# Altium schematic sheet RX_Board.SchDoc (part 4 of 5)
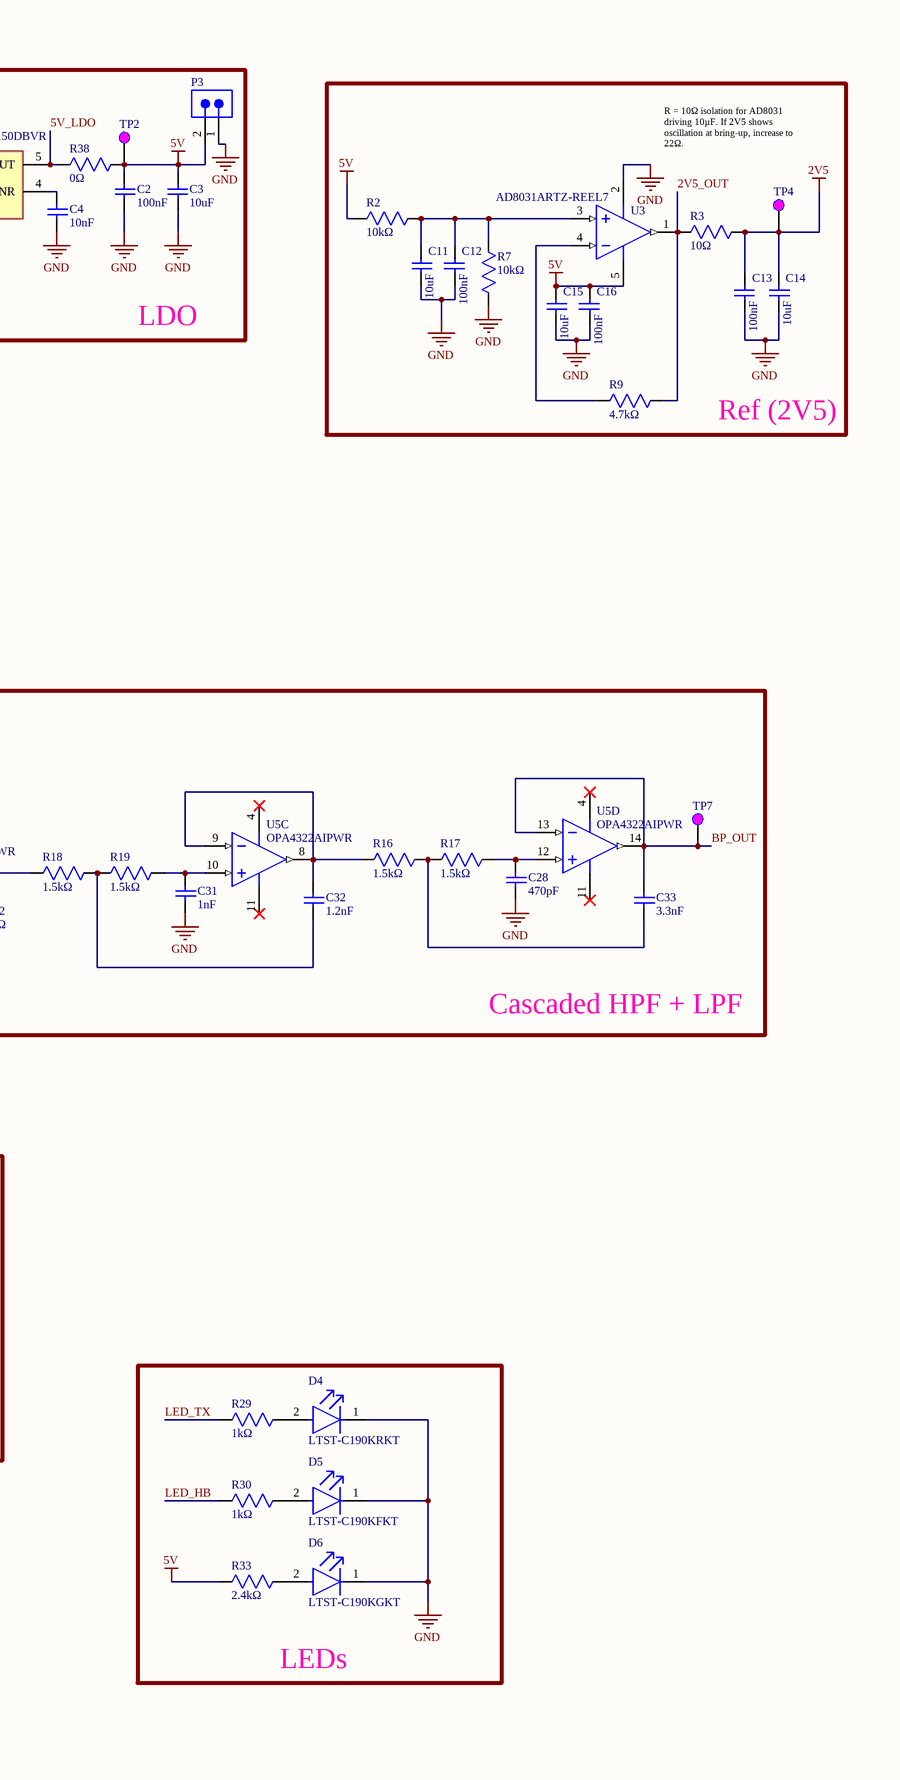
[diagram p4: RX_Board.SchDoc, right]

## Library data of the parts (continued)
R6 R8 R9 R31 = RC0603FR-074K7L: Yageo RC0603FR-074K7L Resistor 0603 SMD 4.7k Ohm 1% 100mW Thick Film; Manufacturer: Yageo Group; Temperature Coefficient: 100ppm/°C; Voltage Rating: 75V; Voltage Rating (DC): 50V; Supplier: Newark; Supplier Part Number: RC0603FR-074K7L; Manufacturer Part Number: RC0603FR-074K7L; RoHS: Compliant; Category: Chip SMD Resistors; Stock: 339015; Pricing: 10=0.018, 20=0.016, 30=0.015, 50=0.013, 100=0.012, 250=0.011, 500=0.010, 1000=0.009 (USD); Case/Package: 0603; Case Code (Imperial): 0603; China RoHS: Non-Compliant; Composition: Thick Film; Contact Plating: Tin; Country of Origin: Mainland China, Taiwan; Depth: 800µm; Export Control Classification Number (ECCN) Code: EAR99; Height: 450µm; Harmonized Tariff Schedule (HTS) Code: 8533.21.00.30; Introduction Date: 2004-09-22; Lead Free: Lead Free; Lead Pitch: 300µm; Length: 1.6mm; Lifecycle Status: Production; Max Operating Temperature: 155°C; Military Standard: Not; Min Operating Temperature: -55°C; Mounting Technology: Surface Mount; Pins: 2; Number of Terminals: 2; Packaging: Tape & Reel; Power Rating: 100mW; Radiation Hardening: No; REACH SVHC: Unaffected; Value: 4.7kΩ; Schedule B: 8533210045, 8533210045|8533210045|8533210045|8533210045|8533210045|8533210045|8533210045|8533210045|8533210045|8533210045|8533210045|8533210045|8533210045|8533210045|8533210045|8533210045|8533210045|8533210045|8533210045|8533210045|8533210045|8533210045|8533210045|85; Termination: SMD/SMT; Tolerance: 1%; Width: 800µm; Working Voltage: 75V; ComponentLink1URL: https://datasheet.octopart.com:443/RC0603FR-074K7L-Yageo-datasheet-175887523.pdf?src-supplier=IHS; ComponentLink1Description: https://datasheet.octopart.com:443/RC0603FR-074K7L-Yageo-datasheet-175887523.pdf?src-supplier=IHS; ComponentLink2URL: https://datasheet.octopart.com:443/RC0603FR-074K7L-Yageo-datasheet-103092701.pdf?src-supplier=Upverter; ComponentLink2Description: https://datasheet.octopart.com:443/RC0603FR-074K7L-Yageo-datasheet-103092701.pdf?src-supplier=Upverter; ComponentLink3URL: https://datasheet.octopart.com:443/RC0603FR-074K7L-Yageo-datasheet-8328172.pdf?src-supplier=Farnell; ComponentLink3Description: https://datasheet.octopart.com:443/RC0603FR-074K7L-Yageo-datasheet-8328172.pdf?src-supplier=Farnell; ComponentLink4URL: https://datasheet.octopart.com:443/RC0603FR-074K7L-Yageo-datasheet-13691069.pdf?src-supplier=Farnell; ComponentLink4Description: https://datasheet.octopart.com:443/RC0603FR-074K7L-Yageo-datasheet-13691069.pdf?src-supplier=Farnell; ComponentLink5URL: https://datasheet.octopart.com:443/RC0603FR-074K7L-Yageo-Group-datasheet-190305687.pdf?src-supplier=Future+Electronics; ComponentLink5Description: https://datasheet.octopart.com:443/RC0603FR-074K7L-Yageo-Group-datasheet-190305687.pdf?src-supplier=Future+Electronics; ComponentLink6URL: https://datasheet.octopart.com:443/RC0603FR-074K7L-Yageo-datasheet-164759695.pdf?src-supplier=Future+Electronics; ComponentLink6Description: https://datasheet.octopart.com:443/RC0603FR-074K7L-Yageo-datasheet-164759695.pdf?src-supplier=Future+Electronics; ComponentLink7URL: https://datasheet.octopart.com:443/RC0603FR-074K7L-Yageo-datasheet-137700087.pdf?src-supplier=Future+Electronics; ComponentLink7Description: https://datasheet.octopart.com:443/RC0603FR-074K7L-Yageo-datasheet-137700087.pdf?src-supplier=Future+Electronics; ComponentLink8URL: https://datasheet.octopart.com:443/RC0603FR074K7L-Yageo-datasheet-27584510.pdf?src-supplier=Future+Electronics; ComponentLink8Description: https://datasheet.octopart.com:443/RC0603FR074K7L-Yageo-datasheet-27584510.pdf?src-supplier=Future+Electronics; ComponentLink9URL: https://datasheet.octopart.com:443/RC0603FR-074K7L-Yageo-datasheet-15599030.pdf?src-supplier=Future+Electronics; ComponentLink9Description: https://datasheet.octopart.com:443/RC0603FR-074K7L-Yageo-datasheet-15599030.pdf?src-supplier=Future+Electronics; ComponentLink10URL: https://datasheet.octopart.com:443/RC0603FR-074K7L-Yageo-datasheet-175423674.pdf?src-supplier=Newark; ComponentLink10Description: https://datasheet.octopart.com:443/RC0603FR-074K7L-Yageo-datasheet-175423674.pdf?src-supplier=Newark; ComponentLink11URL: https://datasheet.octopart.com:443/RC0603FR-074K7L-Yageo-datasheet-12596169.pdf?src-supplier=Newark; ComponentLink11Description: https://datasheet.octopart.com:443/RC0603FR-074K7L-Yageo-datasheet-12596169.pdf?src-supplier=Newark; ComponentLink12URL: https://datasheet.octopart.com:443/RC0603FR-074K7L-Yageo-datasheet-503470.pdf?src-supplier=Newark; ComponentLink12Description: https://datasheet.octopart.com:443/RC0603FR-074K7L-Yageo-datasheet-503470.pdf?src-supplier=Newark; ComponentLink13URL: https://datasheet.octopart.com:443/RC0603FR-074K7L-Yageo-datasheet-34211833.pdf?src-supplier=element14+APAC; ComponentLink13Description: https://datasheet.octopart.com:443/RC0603FR-074K7L-Yageo-datasheet-34211833.pdf?src-supplier=element14+APAC; ComponentLink14URL: https://datasheet.octopart.com:443/RC0603FR-074K7L-Yageo-datasheet-62067350.pdf?src-supplier=element14+APAC; ComponentLink14Description: https://datasheet.octopart.com:443/RC0603FR-074K7L-Yageo-datasheet-62067350.pdf?src-supplier=element14+APAC; ComponentLink15URL: https://datasheet.octopart.com:443/RC0603FR-074K7L-Yageo-datasheet-17842380.pdf?src-supplier=element14+APAC; ComponentLink15Description: https://datasheet.octopart.com:443/RC0603FR-074K7L-Yageo-datasheet-17842380.pdf?src-supplier=element14+APAC; ComponentLink16URL: https://datasheet.octopart.com:443/RC0603FR-074K7L-Yageo-Group-datasheet-189192902.pdf?src-supplier=LCSC; ComponentLink16Description: https://datasheet.octopart.com:443/RC0603FR-074K7L-Yageo-Group-datasheet-189192902.pdf?src-supplier=LCSC; ComponentLink17URL: https://datasheet.octopart.com:443/RC0603FR-074K7L-Yageo-datasheet-79472498.pdf?src-supplier=Megastar; ComponentLink17Description: https://datasheet.octopart.com:443/RC0603FR-074K7L-Yageo-datasheet-79472498.pdf?src-supplier=Megastar; ComponentLink18URL: https://datasheet.octopart.com/RC0603FR-074K7L-Yageo-datasheet-73766026.pdf; ComponentLink18Description: https://datasheet.octopart.com/RC0603FR-074K7L-Yageo-datasheet-73766026.pdf; ComponentLink19URL: https://datasheet.octopart.com:443/RC0603FR-074K7L-Yageo-datasheet-118562.pdf?src-supplier=DigiKey; ComponentLink19Description: https://datasheet.octopart.com:443/RC0603FR-074K7L-Yageo-datasheet-118562.pdf?src-supplier=DigiKey; ComponentLink20URL: http://sigma.octopart.com:80/conflict_mineral_statement/Yageo-company-3.pdf?src-supplier=Compliance+Statements; ComponentLink20Description: http://sigma.octopart.com:80/conflict_mineral_statement/Yageo-company-3.pdf?src-supplier=Compliance+Statements; ComponentLink21URL: http://sigma.octopart.com:80/rohs_statement/Yageo-company-2.pdf?src-supplier=Compliance+Statements; ComponentLink21Description: http://sigma.octopart.com:80/rohs_statement/Yageo-company-2.pdf?src-supplier=Compliance+Statements; JLCPCB Part Number: C99782
R10 = 0603WAF220JT5E: Thick Film Resistors - SMD RMC 0603 1/10W 1% T/R-5000; Manufacturer: Royal Ohm; Supplier: Mouser; Supplier Part Number: 303-0603WAF220JT5E; Manufacturer Part Number: 0603WAF220JT5E; Category: Chip SMD Resistors; Pricing: 10000=0.001 (USD); Value: 22Ω; ComponentLink1URL: https://datasheet.octopart.com:443/0603WAF220JT5E-Royal-Ohm-datasheet-165785611.pdf?src-supplier=TME; ComponentLink1Description: https://datasheet.octopart.com:443/0603WAF220JT5E-Royal-Ohm-datasheet-165785611.pdf?src-supplier=TME; ComponentLink2URL: https://datasheet.octopart.com:443/0603WAF220JT5E-Royal-Ohm-datasheet-157855877.pdf?src-supplier=TME; ComponentLink2Description: https://datasheet.octopart.com:443/0603WAF220JT5E-Royal-Ohm-datasheet-157855877.pdf?src-supplier=TME; ComponentLink3URL: https://datasheet.octopart.com:443/0603WAF220JT5E-Royal-Ohm-datasheet-62069544.pdf?src-supplier=TME; ComponentLink3Description: https://datasheet.octopart.com:443/0603WAF220JT5E-Royal-Ohm-datasheet-62069544.pdf?src-supplier=TME; JLCPCB Part Number: C23345
R11 = 0603WAF5100T5E: Res Thick Film 0603 510 Ohm 1% 0.1W(1/10W) ±100ppm/C Pad SMD T/R; Manufacturer: Royal Ohm; Supplier: Mouser; Supplier Part Number: 303-0603WAF5100T5E; Manufacturer Part Number: 0603WAF5100T5E; Category: Chip SMD Resistors; Pricing: 10000=0.001 (USD); Value: 510Ω; ComponentLink1URL: https://datasheet.octopart.com:443/0603WAF5100T5E-Royal-Ohm-datasheet-165785611.pdf?src-supplier=TME; ComponentLink1Description: https://datasheet.octopart.com:443/0603WAF5100T5E-Royal-Ohm-datasheet-165785611.pdf?src-supplier=TME; ComponentLink2URL: https://datasheet.octopart.com:443/0603WAF5100T5E-Royal-Ohm-datasheet-157855877.pdf?src-supplier=TME; ComponentLink2Description: https://datasheet.octopart.com:443/0603WAF5100T5E-Royal-Ohm-datasheet-157855877.pdf?src-supplier=TME; ComponentLink3URL: https://datasheet.octopart.com:443/0603WAF5100T5E-Royal-Ohm-datasheet-62069544.pdf?src-supplier=TME; ComponentLink3Description: https://datasheet.octopart.com:443/0603WAF5100T5E-Royal-Ohm-datasheet-62069544.pdf?src-supplier=TME; JLCPCB Part Number: C23193
R13 = 0603WAF4702T5E: Res Thick Film 0603 47K Ohm 1% 0.1W(1/10W) ±100ppm/C Pad SMD T/R; Manufacturer: Royal Ohm; Power Rating: 100mW; Temperature Coefficient: 100ppm/°C; Working Voltage: 75V; Supplier: Mouser; Supplier Part Number: 303-0603WAF4702T5E; Manufacturer Part Number: 0603WAF4702T5E; RoHS: Compliant; Category: Chip SMD Resistors; Stock: 65000; Pricing: 10000=0.001 (USD); Case/Package: 0603; China RoHS: Non-Compliant; Country of Origin: Thailand; Export Control Classification Number (ECCN) Code: EAR99; Harmonized Tariff Schedule (HTS) Code: 8533.21.00.30; Introduction Date: 2016-08-18; Lifecycle Status: Production; Max Operating Temperature: 155°C; Min Operating Temperature: -55°C; Mounting Technology: Surface Mount; Number of Terminals: 2; REACH SVHC: Unaffected; Value: 47kΩ; Tolerance: 1%; ComponentLink1URL: https://datasheet.octopart.com:443/0603WAF4702T5E-Royal-Ohm-datasheet-157855877.pdf?src-supplier=IHS; ComponentLink1Description: https://datasheet.octopart.com:443/0603WAF4702T5E-Royal-Ohm-datasheet-157855877.pdf?src-supplier=IHS; ComponentLink2URL: https://datasheet.octopart.com:443/0603WAF4702T5E-Royal-Ohm-datasheet-165785611.pdf?src-supplier=TME; ComponentLink2Description: https://datasheet.octopart.com:443/0603WAF4702T5E-Royal-Ohm-datasheet-165785611.pdf?src-supplier=TME; ComponentLink3URL: https://datasheet.octopart.com:443/0603WAF4702T5E-Royal-Ohm-datasheet-62069544.pdf?src-supplier=TME; ComponentLink3Description: https://datasheet.octopart.com:443/0603WAF4702T5E-Royal-Ohm-datasheet-62069544.pdf?src-supplier=TME; JLCPCB Part Number: C25819
R14 R32 = 0603WAF1000T5E: Res Thick Film 0603 100 Ohm 1% 0.1W(1/10W) ±200ppm/C Pad SMD T/R; Manufacturer: Royal Ohm; Supplier: Mouser; Supplier Part Number: 303-0603WAF1000T5E; Manufacturer Part Number: 0603WAF1000T5E; Category: Chip SMD Resistors; Pricing: 10000=0.001 (USD); Value: 100Ω; ComponentLink1URL: https://datasheet.octopart.com:443/0603WAF1000T5E-Royal-Ohm-datasheet-165785611.pdf?src-supplier=TME; ComponentLink1Description: https://datasheet.octopart.com:443/0603WAF1000T5E-Royal-Ohm-datasheet-165785611.pdf?src-supplier=TME; ComponentLink2URL: https://datasheet.octopart.com:443/0603WAF1000T5E-Royal-Ohm-datasheet-157855877.pdf?src-supplier=TME; ComponentLink2Description: https://datasheet.octopart.com:443/0603WAF1000T5E-Royal-Ohm-datasheet-157855877.pdf?src-supplier=TME; ComponentLink3URL: https://datasheet.octopart.com:443/0603WAF1000T5E-Royal-Ohm-datasheet-62069544.pdf?src-supplier=TME; ComponentLink3Description: https://datasheet.octopart.com:443/0603WAF1000T5E-Royal-Ohm-datasheet-62069544.pdf?src-supplier=TME; JLCPCB Part Number: C22775
R15 = 0603WAF9101T5E: 100mW Thick Film Resistors 75V ±100ppm/℃ ±1% 9.1kΩ 0603 Chip Resistor - Surface Mount ROHS; Manufacturer: Royal Ohm; Supplier: Mouser; Supplier Part Number: 303-0603WAF9101T5E; Manufacturer Part Number: 0603WAF9101T5E; Category: Chip SMD Resistors; Stock: 90000; Pricing: 10000=0.001 (USD); Value: 9.1kΩ; ComponentLink1URL: https://datasheet.octopart.com:443/0603WAF9101T5E-Royal-Ohm-datasheet-165785611.pdf?src-supplier=TME; ComponentLink1Description: https://datasheet.octopart.com:443/0603WAF9101T5E-Royal-Ohm-datasheet-165785611.pdf?src-supplier=TME; ComponentLink2URL: https://datasheet.octopart.com:443/0603WAF9101T5E-Royal-Ohm-datasheet-157855877.pdf?src-supplier=TME; ComponentLink2Description: https://datasheet.octopart.com:443/0603WAF9101T5E-Royal-Ohm-datasheet-157855877.pdf?src-supplier=TME; ComponentLink3URL: https://datasheet.octopart.com:443/0603WAF9101T5E-Royal-Ohm-datasheet-62069544.pdf?src-supplier=TME; ComponentLink3Description: https://datasheet.octopart.com:443/0603WAF9101T5E-Royal-Ohm-datasheet-62069544.pdf?src-supplier=TME; JLCPCB Part Number: C23260
R16-R19 = 0603WAF1501T5E: Res Thick Film 0603 1.5K Ohm 1% 0.1W(1/10W) ±100ppm/C Pad SMD T/R; Manufacturer: Royal Ohm; Power Rating: 100mW; Temperature Coefficient: 100ppm/°C; Working Voltage: 75V; Supplier: Mouser; Supplier Part Number: 303-0603WAF1501T5E; Manufacturer Part Number: 0603WAF1501T5E; RoHS: Compliant; Category: Chip SMD Resistors; Pricing: 5000=0.001, 10000=0.001 (USD); Case/Package: 0603; China RoHS: Non-Compliant; Country of Origin: Thailand; Export Control Classification Number (ECCN) Code: EAR99; Height: 450µm; Harmonized Tariff Schedule (HTS) Code: 8533.21.00.30; Introduction Date: 2013-06-17; Length: 1.6mm; Lifecycle Status: Production; Max Operating Temperature: 155°C; Min Operating Temperature: -55°C; Mounting Technology: Surface Mount; Number of Terminals: 2; REACH SVHC: Unaffected; Value: 1.5kΩ; Tolerance: 1%; Width: 800µm; ComponentLink1URL: https://datasheet.octopart.com:443/0603WAF1501T5E-Royal-Electronics-datasheet-181080982.pdf?src-supplier=IHS; ComponentLink1Description: https://datasheet.octopart.com:443/0603WAF1501T5E-Royal-Electronics-datasheet-181080982.pdf?src-supplier=IHS; ComponentLink2URL: https://datasheet.octopart.com:443/0603WAF1501T5E-Royal-Ohm-datasheet-165785611.pdf?src-supplier=TME; ComponentLink2Description: https://datasheet.octopart.com:443/0603WAF1501T5E-Royal-Ohm-datasheet-165785611.pdf?src-supplier=TME; ComponentLink3URL: https://datasheet.octopart.com:443/0603WAF1501T5E-Royal-Ohm-datasheet-157855877.pdf?src-supplier=TME; ComponentLink3Description: https://datasheet.octopart.com:443/0603WAF1501T5E-Royal-Ohm-datasheet-157855877.pdf?src-supplier=TME; ComponentLink4URL: https://datasheet.octopart.com:443/0603WAF1501T5E-Royal-Ohm-datasheet-62069544.pdf?src-supplier=TME; ComponentLink4Description: https://datasheet.octopart.com:443/0603WAF1501T5E-Royal-Ohm-datasheet-62069544.pdf?src-supplier=TME; JLCPCB Part Number: C22843
R21 = 0603WAF2002T5E: 100mW Thick Film Resistors 75V ±100ppm/℃ ±1% 20kΩ 0603 Chip Resistor - Surface Mount ROHS; Manufacturer: Royal Ohm; Temperature Coefficient: 100ppm/°C; Supplier: Mouser; Supplier Part Number: 303-0603WAF2002T5E; Manufacturer Part Number: 0603WAF2002T5E; RoHS: Compliant; Category: Chip SMD Resistors; Pricing: 10000=0.001 (USD); Case/Package: 0603; China RoHS: Non-Compliant; Country of Origin: Thailand; Export Control Classification Number (ECCN) Code: EAR99; Height: 450µm; Harmonized Tariff Schedule (HTS) Code: 8533.21.00.30; Introduction Date: 2019-05-28; Length: 1.6mm; Lifecycle Status: Production; Max Operating Temperature: 155°C; Min Operating Temperature: -55°C; Mounting Technology: Surface Mount; Number of Terminals: 2; Power Rating: 100mW; REACH SVHC: Unaffected; Value: 20kΩ; Tolerance: 1%; Width: 800µm; Working Voltage: 75V; ComponentLink1URL: https://datasheet.octopart.com:443/0603WAF2002T5E-Royal-Electronics-datasheet-181080982.pdf?src-supplier=IHS; ComponentLink1Description: https://datasheet.octopart.com:443/0603WAF2002T5E-Royal-Electronics-datasheet-181080982.pdf?src-supplier=IHS; ComponentLink2URL: https://datasheet.octopart.com:443/0603WAF2002T5E-Royal-Ohm-datasheet-165785611.pdf?src-supplier=TME; ComponentLink2Description: https://datasheet.octopart.com:443/0603WAF2002T5E-Royal-Ohm-datasheet-165785611.pdf?src-supplier=TME; ComponentLink3URL: https://datasheet.octopart.com:443/0603WAF2002T5E-Royal-Ohm-datasheet-157855877.pdf?src-supplier=TME; ComponentLink3Description: https://datasheet.octopart.com:443/0603WAF2002T5E-Royal-Ohm-datasheet-157855877.pdf?src-supplier=TME; ComponentLink4URL: https://datasheet.octopart.com:443/0603WAF2002T5E-Royal-Ohm-datasheet-62069544.pdf?src-supplier=TME; ComponentLink4Description: https://datasheet.octopart.com:443/0603WAF2002T5E-Royal-Ohm-datasheet-62069544.pdf?src-supplier=TME; JLCPCB Part Number: C4184
R22 = 0603WAF3001T5E: Thick Film Resistors - SMD RMC 0603 1/10W 1% T/R-5000; Manufacturer: Royal Ohm; Supplier: Mouser; Supplier Part Number: 303-0603WAF3001T5E; Manufacturer Part Number: 0603WAF3001T5E; Category: Chip SMD Resistors; Stock: 20000; Pricing: 10000=0.001 (USD); Value: 3kΩ; ComponentLink1URL: https://datasheet.octopart.com:443/0603WAF3001T5E-Royal-Ohm-datasheet-165785611.pdf?src-supplier=TME; ComponentLink1Description: https://datasheet.octopart.com:443/0603WAF3001T5E-Royal-Ohm-datasheet-165785611.pdf?src-supplier=TME; ComponentLink2URL: https://datasheet.octopart.com:443/0603WAF3001T5E-Royal-Ohm-datasheet-157855877.pdf?src-supplier=TME; ComponentLink2Description: https://datasheet.octopart.com:443/0603WAF3001T5E-Royal-Ohm-datasheet-157855877.pdf?src-supplier=TME; ComponentLink3URL: https://datasheet.octopart.com:443/0603WAF3001T5E-Royal-Ohm-datasheet-62069544.pdf?src-supplier=TME; ComponentLink3Description: https://datasheet.octopart.com:443/0603WAF3001T5E-Royal-Ohm-datasheet-62069544.pdf?src-supplier=TME; JLCPCB Part Number: C4211
R23 = 0603WAF8200T5E: Thick Film Resistors - SMD RMC 0603 1/10W 1% T/R-5000; Manufacturer: Royal Ohm; Supplier: Mouser; Supplier Part Number: 303-0603WAF8200T5E; Manufacturer Part Number: 0603WAF8200T5E; Category: Chip SMD Resistors; Pricing: 10000=0.001 (USD); Value: 820Ω; ComponentLink1URL: https://datasheet.octopart.com:443/0603WAF8200T5E-Royal-Ohm-datasheet-165785611.pdf?src-supplier=TME; ComponentLink1Description: https://datasheet.octopart.com:443/0603WAF8200T5E-Royal-Ohm-datasheet-165785611.pdf?src-supplier=TME; ComponentLink2URL: https://datasheet.octopart.com:443/0603WAF8200T5E-Royal-Ohm-datasheet-157855877.pdf?src-supplier=TME; ComponentLink2Description: https://datasheet.octopart.com:443/0603WAF8200T5E-Royal-Ohm-datasheet-157855877.pdf?src-supplier=TME; ComponentLink3URL: https://datasheet.octopart.com:443/0603WAF8200T5E-Royal-Ohm-datasheet-62069544.pdf?src-supplier=TME; ComponentLink3Description: https://datasheet.octopart.com:443/0603WAF8200T5E-Royal-Ohm-datasheet-62069544.pdf?src-supplier=TME; JLCPCB Part Number: C23253
R24 = 0603WAF8201T5E: Res Thick Film 0603 8.2K Ohm 1% 0.1W(1/10W) ±100ppm/C Pad SMD T/R; Manufacturer: Royal Ohm; Supplier: Mouser; Supplier Part Number: 303-0603WAF8201T5E; Manufacturer Part Number: 0603WAF8201T5E; Category: Chip SMD Resistors; Pricing: 10000=0.001 (USD); Value: 8.2kΩ; ComponentLink1URL: https://datasheet.octopart.com:443/0603WAF8201T5E-Royal-Ohm-datasheet-165785611.pdf?src-supplier=TME; ComponentLink1Description: https://datasheet.octopart.com:443/0603WAF8201T5E-Royal-Ohm-datasheet-165785611.pdf?src-supplier=TME; ComponentLink2URL: https://datasheet.octopart.com:443/0603WAF8201T5E-Royal-Ohm-datasheet-157855877.pdf?src-supplier=TME; ComponentLink2Description: https://datasheet.octopart.com:443/0603WAF8201T5E-Royal-Ohm-datasheet-157855877.pdf?src-supplier=TME; ComponentLink3URL: https://datasheet.octopart.com:443/0603WAF8201T5E-Royal-Ohm-datasheet-62069544.pdf?src-supplier=TME; ComponentLink3Description: https://datasheet.octopart.com:443/0603WAF8201T5E-Royal-Ohm-datasheet-62069544.pdf?src-supplier=TME; JLCPCB Part Number: C25981
R25 = 0603WAF7501T5E: Fixed Resistor, Metal Glaze/thick Film, 0.1W, 7500ohm, 75V, 1% +/-Tol, 100ppm/Cel, Surface Mount, 0603; Manufacturer: Royal Ohm; Power Rating: 100mW; Temperature Coefficient: 100ppm/°C; Supplier: Mouser; Supplier Part Number: 303-0603WAF7501T5E; Manufacturer Part Number: 0603WAF7501T5E; RoHS: Compliant; Category: Chip SMD Resistors; Pricing: 10000=0.001 (USD); Case/Package: 0603; Height: 450µm; Length: 1.6mm; Lifecycle Status: Production; Max Operating Temperature: 155°C; Min Operating Temperature: -55°C; Mounting Technology: Surface Mount; Number of Terminals: 2; REACH SVHC: Unaffected; Value: 7.5kΩ; Tolerance: 1%; Width: 800µm; Working Voltage: 75V; ComponentLink1URL: https://datasheet.octopart.com:443/0603WAF7501T5E-Royal-Electronics-datasheet-181080982.pdf?src-supplier=IHS; ComponentLink1Description: https://datasheet.octopart.com:443/0603WAF7501T5E-Royal-Electronics-datasheet-181080982.pdf?src-supplier=IHS; ComponentLink2URL: https://datasheet.octopart.com:443/0603WAF7501T5E-Royal-Ohm-datasheet-165785611.pdf?src-supplier=TME; ComponentLink2Description: https://datasheet.octopart.com:443/0603WAF7501T5E-Royal-Ohm-datasheet-165785611.pdf?src-supplier=TME; ComponentLink3URL: https://datasheet.octopart.com:443/0603WAF7501T5E-Royal-Ohm-datasheet-157855877.pdf?src-supplier=TME; ComponentLink3Description: https://datasheet.octopart.com:443/0603WAF7501T5E-Royal-Ohm-datasheet-157855877.pdf?src-supplier=TME; ComponentLink4URL: https://datasheet.octopart.com:443/0603WAF7501T5E-Royal-Ohm-datasheet-62069544.pdf?src-supplier=TME; ComponentLink4Description: https://datasheet.octopart.com:443/0603WAF7501T5E-Royal-Ohm-datasheet-62069544.pdf?src-supplier=TME; JLCPCB Part Number: C23234
R26 = 0603WAF5601T5E: Res Thick Film 0603 5.6K Ohm 1% 0.1W(1/10W) ±100ppm/C Pad SMD T/R; Manufacturer: Royal Ohm; Power Rating: 100mW; Temperature Coefficient: 100ppm/°C; Working Voltage: 75V; Supplier: Mouser; Supplier Part Number: 303-0603WAF5601T5E; Manufacturer Part Number: 0603WAF5601T5E; RoHS: Compliant; Category: Chip SMD Resistors; Pricing: 10000=0.001 (USD); Case/Package: 0603; China RoHS: Non-Compliant; Country of Origin: Thailand; Export Control Classification Number (ECCN) Code: EAR99; Harmonized Tariff Schedule (HTS) Code: 8533.21.00.30; Introduction Date: 2016-08-18; Lifecycle Status: Production; Max Operating Temperature: 155°C; Min Operating Temperature: -55°C; Mounting Technology: Surface Mount; Number of Terminals: 2; REACH SVHC: Unaffected; Value: 5.6kΩ; Tolerance: 1%; ComponentLink1URL: https://datasheet.octopart.com:443/0603WAF5601T5E-Royal-Ohm-datasheet-157855877.pdf?src-supplier=IHS; ComponentLink1Description: https://datasheet.octopart.com:443/0603WAF5601T5E-Royal-Ohm-datasheet-157855877.pdf?src-supplier=IHS; ComponentLink2URL: https://datasheet.octopart.com:443/0603WAF5601T5E-Royal-Ohm-datasheet-165785611.pdf?src-supplier=TME; ComponentLink2Description: https://datasheet.octopart.com:443/0603WAF5601T5E-Royal-Ohm-datasheet-165785611.pdf?src-supplier=TME; ComponentLink3URL: https://datasheet.octopart.com:443/0603WAF5601T5E-Royal-Ohm-datasheet-62069544.pdf?src-supplier=TME; ComponentLink3Description: https://datasheet.octopart.com:443/0603WAF5601T5E-Royal-Ohm-datasheet-62069544.pdf?src-supplier=TME; JLCPCB Part Number: C23189
R27 = 0603WAF3301T5E: Fixed Resistor, Metal Glaze/thick Film, 0.1W, 3300ohm, 75V, 1% +/-Tol, 100ppm/Cel, Surface Mount, 0603; Manufacturer: Royal Ohm; Power Rating: 100mW; Temperature Coefficient: 100ppm/°C; Supplier: Mouser; Supplier Part Number: 303-0603WAF3301T5E; Manufacturer Part Number: 0603WAF3301T5E; RoHS: Compliant; Category: Chip SMD Resistors; Pricing: 10000=0.001 (USD); Case/Package: 0603; China RoHS: Non-Compliant; Country of Origin: Thailand; Export Control Classification Number (ECCN) Code: EAR99; Harmonized Tariff Schedule (HTS) Code: 8533.21.00.30; Introduction Date: 2016-08-18; Lifecycle Status: Production; Max Operating Temperature: 155°C; Min Operating Temperature: -55°C; Mounting Technology: Surface Mount; Number of Terminals: 2; REACH SVHC: Unaffected; Value: 3.3kΩ; Tolerance: 1%; Working Voltage: 75V; ComponentLink1URL: https://datasheet.octopart.com:443/0603WAF3301T5E-Royal-Ohm-datasheet-157855877.pdf?src-supplier=IHS; ComponentLink1Description: https://datasheet.octopart.com:443/0603WAF3301T5E-Royal-Ohm-datasheet-157855877.pdf?src-supplier=IHS; ComponentLink2URL: https://datasheet.octopart.com:443/0603WAF3301T5E-Royal-Ohm-datasheet-165785611.pdf?src-supplier=TME; ComponentLink2Description: https://datasheet.octopart.com:443/0603WAF3301T5E-Royal-Ohm-datasheet-165785611.pdf?src-supplier=TME; ComponentLink3URL: https://datasheet.octopart.com:443/0603WAF3301T5E-Royal-Ohm-datasheet-62069544.pdf?src-supplier=TME; ComponentLink3Description: https://datasheet.octopart.com:443/0603WAF3301T5E-Royal-Ohm-datasheet-62069544.pdf?src-supplier=TME; JLCPCB Part Number: C22978
R29 R30 = 0603WAF1001T5E: Res Thick Film 0603 1K Ohm 1% 0.1W(1/10W) ±100ppm/C Pad SMD T/R; Manufacturer: Royal Ohm; Power Rating: 100mW; Temperature Coefficient: 100ppm/°C; Working Voltage: 75V; Supplier: Mouser; Supplier Part Number: 303-0603WAF1001T5E; Manufacturer Part Number: 0603WAF1001T5E; RoHS: Compliant; Category: Chip SMD Resistors; Stock: 260000; Pricing: 10000=0.001 (USD); Case/Package: 0603; China RoHS: Non-Compliant; Country of Origin: Thailand; Export Control Classification Number (ECCN) Code: EAR99; Height: 450µm; Harmonized Tariff Schedule (HTS) Code: 8533.21.00.30; Introduction Date: 2006-01-09; Length: 1.6mm; Lifecycle Status: Production; Max Operating Temperature: 155°C; Min Operating Temperature: -55°C; Mounting Technology: Surface Mount; Number of Terminals: 2; REACH SVHC: Unaffected; Value: 1kΩ; Tolerance: 1%; Width: 800µm; ComponentLink1URL: https://datasheet.octopart.com:443/0603WAF1001T5E-Royal-Electronics-datasheet-181080982.pdf?src-supplier=IHS; ComponentLink1Description: https://datasheet.octopart.com:443/0603WAF1001T5E-Royal-Electronics-datasheet-181080982.pdf?src-supplier=IHS; ComponentLink2URL: https://datasheet.octopart.com:443/0603WAF1001T5E-Royal-Ohm-datasheet-165785611.pdf?src-supplier=TME; ComponentLink2Description: https://datasheet.octopart.com:443/0603WAF1001T5E-Royal-Ohm-datasheet-165785611.pdf?src-supplier=TME; ComponentLink3URL: https://datasheet.octopart.com:443/0603WAF1001T5E-Royal-Ohm-datasheet-157855877.pdf?src-supplier=TME; ComponentLink3Description: https://datasheet.octopart.com:443/0603WAF1001T5E-Royal-Ohm-datasheet-157855877.pdf?src-supplier=TME; ComponentLink4URL: https://datasheet.octopart.com:443/0603WAF1001T5E-Royal-Ohm-datasheet-62069544.pdf?src-supplier=TME; ComponentLink4Description: https://datasheet.octopart.com:443/0603WAF1001T5E-Royal-Ohm-datasheet-62069544.pdf?src-supplier=TME; JLCPCB Part Number: C21190
R33 = 0603WAF2401T5E: 100mW Thick Film Resistors 75V ±100ppm/℃ ±1% 2.4kΩ 0603 Chip Resistor - Surface Mount ROHS; Manufacturer: Royal Ohm; Supplier: Mouser; Supplier Part Number: 303-0603WAF2401T5E; Manufacturer Part Number: 0603WAF2401T5E; Category: Chip SMD Resistors; Pricing: 10000=0.001 (USD); Value: 2.4kΩ; ComponentLink1URL: https://datasheet.octopart.com:443/0603WAF2401T5E-Royal-Ohm-datasheet-165785611.pdf?src-supplier=TME; ComponentLink1Description: https://datasheet.octopart.com:443/0603WAF2401T5E-Royal-Ohm-datasheet-165785611.pdf?src-supplier=TME; ComponentLink2URL: https://datasheet.octopart.com:443/0603WAF2401T5E-Royal-Ohm-datasheet-157855877.pdf?src-supplier=TME; ComponentLink2Description: https://datasheet.octopart.com:443/0603WAF2401T5E-Royal-Ohm-datasheet-157855877.pdf?src-supplier=TME; ComponentLink3URL: https://datasheet.octopart.com:443/0603WAF2401T5E-Royal-Ohm-datasheet-62069544.pdf?src-supplier=TME; ComponentLink3Description: https://datasheet.octopart.com:443/0603WAF2401T5E-Royal-Ohm-datasheet-62069544.pdf?src-supplier=TME; JLCPCB Part Number: C22940
R36 = RC0603FR-0782RL: SMD Chip Resistor, 82 Ohm, ¡À 1%, 100 mW, 0603 [1608 Metric], Thick Film, General Purpose; Manufacturer: Yageo Group; Max Power Dissipation: 100mW; Temperature Coefficient: 100ppm/°C; Voltage Rating: 75V; Voltage Rating (AC): 50V; Supplier: Newark; Supplier Part Number: RC0603FR-0782RL; Manufacturer Part Number: RC0603FR-0782RL; RoHS: Compliant; Category: Chip SMD Resistors; Stock: 20000; Pricing: 5000=0.004, 15000=0.003, 25000=0.002 (USD); Case/Package: 0603; Case Code (Imperial): 0603; Case Code (Metric): 0603; China RoHS: Non-Compliant; Composition: Thick Film; Country of Origin: Mainland China, Taiwan; Depth: 800µm; Export Control Classification Number (ECCN) Code: EAR99; Features: Moisture Resistant; Height: 450µm; Harmonized Tariff Schedule (HTS) Code: 8533.21.00.30; Introduction Date: 2008-07-18; Lead Free: Lead Free; Length: 1.6mm; Lifecycle Status: Production; Max Operating Temperature: 155°C; Min Operating Temperature: -55°C; Mounting Technology: Surface Mount; Pins: 2; Number of Terminals: 2; Number of Terminations: 2; Packaging: Tape & Reel; Power Rating: 100mW; REACH SVHC: Unaffected; Value: 82Ω; Schedule B: 8533210045, 8533210045¦8533210045, 8533210045¦8533210045¦8533210045, 8533210045¦8533210045¦8533210045¦8533210045; Termination: SMD/SMT; Tolerance: 1%; Voltage Rating (DC): 50V; Width: 800µm; Working Voltage: 75V; ComponentLink1URL: https://datasheet.octopart.com:443/RC0603FR-0782RL-Yageo-datasheet-175887523.pdf?src-supplier=IHS; ComponentLink1Description: https://datasheet.octopart.com:443/RC0603FR-0782RL-Yageo-datasheet-175887523.pdf?src-supplier=IHS; ComponentLink2URL: https://datasheet.octopart.com:443/RC0603FR-0782RL-Yageo-datasheet-103092701.pdf?src-supplier=Upverter; ComponentLink2Description: https://datasheet.octopart.com:443/RC0603FR-0782RL-Yageo-datasheet-103092701.pdf?src-supplier=Upverter; ComponentLink3URL: https://datasheet.octopart.com:443/RC0603FR-0782RL-Yageo-Group-datasheet-190305687.pdf?src-supplier=Future+Electronics; ComponentLink3Description: https://datasheet.octopart.com:443/RC0603FR-0782RL-Yageo-Group-datasheet-190305687.pdf?src-supplier=Future+Electronics; ComponentLink4URL: https://datasheet.octopart.com:443/RC0603FR-0782RL-Yageo-datasheet-164759695.pdf?src-supplier=Future+Electronics; ComponentLink4Description: https://datasheet.octopart.com:443/RC0603FR-0782RL-Yageo-datasheet-164759695.pdf?src-supplier=Future+Electronics; ComponentLink5URL: https://datasheet.octopart.com:443/RC0603FR-0782RL-Yageo-datasheet-137700087.pdf?src-supplier=Future+Electronics; ComponentLink5Description: https://datasheet.octopart.com:443/RC0603FR-0782RL-Yageo-datasheet-137700087.pdf?src-supplier=Future+Electronics; ComponentLink6URL: https://datasheet.octopart.com:443/RC0603FR-0782RL-Yageo-datasheet-27584510.pdf?src-supplier=Future+Electronics; ComponentLink6Description: https://datasheet.octopart.com:443/RC0603FR-0782RL-Yageo-datasheet-27584510.pdf?src-supplier=Future+Electronics; ComponentLink7URL: https://datasheet.octopart.com:443/RC0603FR-0782RL-Yageo-datasheet-15599030.pdf?src-supplier=Future+Electronics; ComponentLink7Description: https://datasheet.octopart.com:443/RC0603FR-0782RL-Yageo-datasheet-15599030.pdf?src-supplier=Future+Electronics; ComponentLink8URL: https://datasheet.octopart.com:443/RC0603FR-0782RL-Yageo-datasheet-12596169.pdf?src-supplier=Future+Electronics; ComponentLink8Description: https://datasheet.octopart.com:443/RC0603FR-0782RL-Yageo-datasheet-12596169.pdf?src-supplier=Future+Electronics; ComponentLink9URL: https://datasheet.octopart.com:443/RC0603FR-0782RL-Yageo-datasheet-503470.pdf?src-supplier=Future+Electronics; ComponentLink9Description: https://datasheet.octopart.com:443/RC0603FR-0782RL-Yageo-datasheet-503470.pdf?src-supplier=Future+Electronics; ComponentLink10URL: https://datasheet.octopart.com:443/RC0603FR-0782RL-Yageo-datasheet-8328172.pdf?src-supplier=Newark; ComponentLink10Description: https://datasheet.octopart.com:443/RC0603FR-0782RL-Yageo-datasheet-8328172.pdf?src-supplier=Newark; ComponentLink11URL: https://datasheet.octopart.com:443/RC0603FR-0782RL-Yageo-datasheet-34211833.pdf?src-supplier=Newark; ComponentLink11Description: https://datasheet.octopart.com:443/RC0603FR-0782RL-Yageo-datasheet-34211833.pdf?src-supplier=Newark; ComponentLink12URL: https://datasheet.octopart.com:443/RC0603FR-0782RL-Yageo-datasheet-62067350.pdf?src-supplier=Newark; ComponentLink12Description: https://datasheet.octopart.com:443/RC0603FR-0782RL-Yageo-datasheet-62067350.pdf?src-supplier=Newark; ComponentLink13URL: https://datasheet.octopart.com:443/RC0603FR-0782RL-Yageo-Group-datasheet-189192902.pdf?src-supplier=LCSC; ComponentLink13Description: https://datasheet.octopart.com:443/RC0603FR-0782RL-Yageo-Group-datasheet-189192902.pdf?src-supplier=LCSC; ComponentLink14URL: https://datasheet.octopart.com:443/RC0603FR-0782RL-Yageo-datasheet-176638170.pdf?src-supplier=JRH+Electronics; ComponentLink14Description: https://datasheet.octopart.com:443/RC0603FR-0782RL-Yageo-datasheet-176638170.pdf?src-supplier=JRH+Electronics; ComponentLink15URL: https://datasheet.octopart.com:443/RC0603FR-0782RL-Yageo-datasheet-148775077.pdf?src-supplier=TME; ComponentLink15Description: https://datasheet.octopart.com:443/RC0603FR-0782RL-Yageo-datasheet-148775077.pdf?src-supplier=TME; ComponentLink16URL: https://datasheet.octopart.com/RC0603FR-0782RL-Yageo-datasheet-73766026.pdf; ComponentLink16Description: https://datasheet.octopart.com/RC0603FR-0782RL-Yageo-datasheet-73766026.pdf; ComponentLink17URL: https://datasheet.octopart.com:443/RC0603FR-0782RL-Yageo-datasheet-118562.pdf?src-supplier=DigiKey; ComponentLink17Description: https://datasheet.octopart.com:443/RC0603FR-0782RL-Yageo-datasheet-118562.pdf?src-supplier=DigiKey; ComponentLink18URL: http://sigma.octopart.com:80/conflict_mineral_statement/Yageo-company-3.pdf?src-supplier=Compliance+Statements; ComponentLink18Description: http://sigma.octopart.com:80/conflict_mineral_statement/Yageo-company-3.pdf?src-supplier=Compliance+Statements; ComponentLink19URL: http://sigma.octopart.com:80/rohs_statement/Yageo-company-2.pdf?src-supplier=Compliance+Statements; ComponentLink19Description: http://sigma.octopart.com:80/rohs_statement/Yageo-company-2.pdf?src-supplier=Compliance+Statements; JLCPCB Part Number: C137676
R37 = 0603WAF3300T5E: Fixed Resistor, Metal Glaze/thick Film, 0.1W, 330ohm, 75V, 1% +/-Tol, 100ppm/Cel, Surface Mount, 0603; Manufacturer: Royal Ohm; Power Rating: 100mW; Temperature Coefficient: 100ppm/°C; Supplier: Mouser; Supplier Part Number: 303-0603WAF3300T5E; Manufacturer Part Number: 0603WAF3300T5E; RoHS: Compliant; Category: Chip SMD Resistors; Pricing: 10000=0.001 (USD); Case/Package: 0603; China RoHS: Non-Compliant; Country of Origin: Thailand; Export Control Classification Number (ECCN) Code: EAR99; Harmonized Tariff Schedule (HTS) Code: 8533.21.00.30; Introduction Date: 2016-08-18; Lifecycle Status: Production; Max Operating Temperature: 155°C; Min Operating Temperature: -55°C; Mounting Technology: Surface Mount; Number of Terminals: 2; REACH SVHC: Unaffected; Value: 330Ω; Tolerance: 1%; Working Voltage: 75V; ComponentLink1URL: https://datasheet.octopart.com:443/0603WAF3300T5E-Royal-Ohm-datasheet-157855877.pdf?src-supplier=IHS; ComponentLink1Description: https://datasheet.octopart.com:443/0603WAF3300T5E-Royal-Ohm-datasheet-157855877.pdf?src-supplier=IHS; ComponentLink2URL: https://datasheet.octopart.com:443/0603WAF3300T5E-Royal-Ohm-datasheet-165785611.pdf?src-supplier=TME; ComponentLink2Description: https://datasheet.octopart.com:443/0603WAF3300T5E-Royal-Ohm-datasheet-165785611.pdf?src-supplier=TME; ComponentLink3URL: https://datasheet.octopart.com:443/0603WAF3300T5E-Royal-Ohm-datasheet-62069544.pdf?src-supplier=TME; ComponentLink3Description: https://datasheet.octopart.com:443/0603WAF3300T5E-Royal-Ohm-datasheet-62069544.pdf?src-supplier=TME; JLCPCB Part Number: C23138
R38 = RC0603FR-070RL: Zero Ohm Resistor, Jumper, 0603 [1608 Metric], Thick Film, 100 mW, 1 A, Surface Mount; Manufacturer: Yageo Group; Current Rating: 1A; Max Power Dissipation: 100mW; Temperature Coefficient: 200ppm/°C; Tolerance: 1%; Voltage Rating: 75V; Voltage Rating (DC): 50V; Supplier: Avnet; Supplier Part Number: RC0603FR-070RL; Manufacturer Part Number: RC0603FR-070RL; RoHS: Compliant; Category: Chip SMD Resistors; Stock: 190618; Pricing: 1=0.101, 25=0.009, 100=0.008, 250=0.007, 500=0.006, 1000=0.005, 2500=0.004 (USD); Case/Package: 0603; Case Code (Imperial): 0603; China RoHS: Non-Compliant; Composition: Thick Film; Contact Plating: Tin; Depth: 800µm; Features: Moisture Resistant; Height: 450µm; Lead Free: Lead Free; Length: 1.6mm; Lifecycle Status: Production; Max Operating Temperature: 155°C; Military Standard: Not; Min Operating Temperature: -55°C; Mounting Technology: Surface Mount; Pins: 2; Number of Terminals: 2; Number of Terminations: 2; Packaging: Tape & Reel; Power Rating: 100mW; Radiation Hardening: No; REACH SVHC: Unaffected; Value: 0Ω; Schedule B: 8533210045, 8533210045|8533210045|8533210045|8533210045|8533210045; Termination: SMD/SMT; Width: 800µm; Working Voltage: 75V; ComponentLink1URL: https://datasheet.octopart.com:443/RC0603FR-070RL-Yageo-datasheet-127823281.pdf?src-supplier=Upverter; ComponentLink1Description: https://datasheet.octopart.com:443/RC0603FR-070RL-Yageo-datasheet-127823281.pdf?src-supplier=Upverter; ComponentLink2URL: https://datasheet.octopart.com:443/RC0603FR-070RL-Yageo-datasheet-30459151.pdf?src-supplier=IHS; ComponentLink2Description: https://datasheet.octopart.com:443/RC0603FR-070RL-Yageo-datasheet-30459151.pdf?src-supplier=IHS; ComponentLink3URL: https://datasheet.octopart.com:443/RC0603FR-070RL-Yageo-datasheet-8328172.pdf?src-supplier=element14+APAC; ComponentLink3Description: https://datasheet.octopart.com:443/RC0603FR-070RL-Yageo-datasheet-8328172.pdf?src-supplier=element14+APAC; ComponentLink4URL: https://datasheet.octopart.com:443/RC0603FR-070RL-Yageo-datasheet-34211833.pdf?src-supplier=Newark; ComponentLink4Description: https://datasheet.octopart.com:443/RC0603FR-070RL-Yageo-datasheet-34211833.pdf?src-supplier=Newark; ComponentLink5URL: https://datasheet.octopart.com:443/RC0603FR-070RL-Yageo-Group-datasheet-176638170.pdf?src-supplier=Future+Electronics; ComponentLink5Description: https://datasheet.octopart.com:443/RC0603FR-070RL-Yageo-Group-datasheet-176638170.pdf?src-supplier=Future+Electronics; ComponentLink6URL: https://datasheet.octopart.com:443/RC0603FR-070RL-Yageo-datasheet-164759695.pdf?src-supplier=Future+Electronics; ComponentLink6Description: https://datasheet.octopart.com:443/RC0603FR-070RL-Yageo-datasheet-164759695.pdf?src-supplier=Future+Electronics; ComponentLink7URL: https://datasheet.octopart.com:443/RC0603FR-070RL-Yageo-datasheet-137700087.pdf?src-supplier=Future+Electronics; ComponentLink7Description: https://datasheet.octopart.com:443/RC0603FR-070RL-Yageo-datasheet-137700087.pdf?src-supplier=Future+Electronics; ComponentLink8URL: https://datasheet.octopart.com:443/RC0603FR-070RL-Yageo-datasheet-15599030.pdf?src-supplier=Future+Electronics; ComponentLink8Description: https://datasheet.octopart.com:443/RC0603FR-070RL-Yageo-datasheet-15599030.pdf?src-supplier=Future+Electronics; ComponentLink9URL: https://datasheet.octopart.com:443/RC0603FR-070RL-Yageo-datasheet-12596169.pdf?src-supplier=Future+Electronics; ComponentLink9Description: https://datasheet.octopart.com:443/RC0603FR-070RL-Yageo-datasheet-12596169.pdf?src-supplier=Future+Electronics; ComponentLink10URL: https://datasheet.octopart.com/RC0603FR-070RL-Yageo-datasheet-73766026.pdf; ComponentLink10Description: https://datasheet.octopart.com/RC0603FR-070RL-Yageo-datasheet-73766026.pdf; ComponentLink11URL: http://sigma.octopart.com:80/conflict_mineral_statement/Yageo-company-3.pdf?src-supplier=Compliance+Statements; ComponentLink11Description: http://sigma.octopart.com:80/conflict_mineral_statement/Yageo-company-3.pdf?src-supplier=Compliance+Statements; ComponentLink12URL: http://sigma.octopart.com:80/rohs_statement/Yageo-company-2.pdf?src-supplier=Compliance+Statements; ComponentLink12Description: http://sigma.octopart.com:80/rohs_statement/Yageo-company-2.pdf?src-supplier=Compliance+Statements; JLCPCB Part Number: C100044
U1 = CMP-04918-000358-1: IC REG BUCK ADJ 75MA SOT23-8; Switching Frequency: 800kHz; Synchronous Rectifier: Yes; Number of Outputs: 1; Efficiency: 96%; Max Output Voltage: 5.5V; Quiescent Current: 11uA; Output Type: Adjustable; Min Input Voltage: 2V; Operating Supply Voltage: 15V; Min Output Voltage: 1.2V; RoHS Compliant: Yes; Series: -; Max Output Current: 75mA; Min Operating Temperature: -40°C; Radiation Hardening: No; Package Quantity: 1; Mount: Surface Mount; Max Operating Temperature: 85°C; Case/Package: SOT-23-8; REACH SVHC: No SVHC; Packaging: Tape and Reel; Lead Free: Lead Free; Output Current: 75mA; Max Input Voltage: 15V; Output Voltage: 5.5V; Number of Pins: 8
U2 = CMP-0394-00659-2: Single Output Fast Transient Response LDO, 150 mA, Fixed 5 V Output, 1.7 to 5.5 V Input, 5-pin SOT-23 (DBV), -40 to 85 degC, Green (RoHS & no Sb/Br); Manufacturer: Texas Instruments; Iout(Max)(A): 0.15; SubFamily: Single Channel LDO; Iq(Typ)(mA): 0.4; Vin(Min)(V): 1.7; Vin(Max)(V): 5.5; Vdo(Typ)(mV): 30; Vout Adj(Min)(V): 5; Accuracy(%): 1; PartNumber: TPS73150DBVR; ComponentLink1Description: Manufacturer URL; Eco-Plan: Green (RoHS & no Sb/Br); DatasheetVersion: SBVS034M; Mounting Technology: Surface Mount; PackageReference: DBV0005A; ComponentLink1URL: http://www.ti.com/; ComponentLink3Description: Package Specification; Code_JEDEC: MO-178; Vout Adj(Max)(V): 5; Fixed Output Options(V): 5; PackageDescription: 5-Pin Plastic Small Outline, Body 1.60 Ãƒâ€” 2.90 mm, Pitch 0.95 mm; ComponentLink3URL: http://www.ti.com/litv/pdf/mpds018i; ComponentLink2URL: http://www.ti.com/general/docs/lit/getliterature.tsp?genericPartNumber=TPS73150&fileType=pdf; ComponentLink2Description: Datasheet; PackageVersion: 4073253-4/K
U3 = CMP-0384-01443-3: Single Channel RRIO Operational Amplifier, 80 MHz BW, 35 V/us SR, Industrial, 5-pin SOT23 (RJ-5), Reel; Manufacturer: Analog Devices; Generic Part Number: AD8031; V Span Max: 12V; Slew Rate: 35V/us; Input Bias Current: 450nA; Amplifiers Per Package: 1; V Span Min: 2.7V; Iq/Amp: 900uA; Small Signal Bandwidth: 80MHz; Input Offset Voltage: 1mV; ComponentLink4URL: http://www.analog.com/en/all-operational-amplifiers-op-amps/operational-amplifiers-op-amps/ad8031/products/product.html#product-recommendations; PackageDescription: 5-Pin Small Outline Transistor Package, Body 2.9 x 1.6 mm, Pitch 0.95 mm; Mounting Technology: Surface Mount; PackageReference: RJ-5; ComponentLink2Description: Datasheet; ComponentLink1Description: Manufacturer URL; PartNumber: AD8031ARTZ-REEL7; ComponentLink2URL: http://www.analog.com/static/imported-files/data_sheets/AD8031_8032.pdf; ComponentLink3URL: http://www.analog.com/static/imported-files/packages/PKG_PDF/SOT-23(RJ)/RJ_5.pdf; ComponentLink1URL: http://www.analog.com/en/index.html; RevisionNote: Reference Circuit URL fixed; ComponentLink3Description: Package Specification; ComponentLink4Description: Reference Circuit; PackageVersion: 121608-A; DatasheetVersion: Rev. D; Packing: Reel; Code_JEDEC: MO-178-AA
U4 = CMP-09116-000031-1: IC OPAMP VFB 1 CIRCUIT SC70-6; Manufacturer: Analog Devices; Input Offset Voltage: 0.020mV; Voltage Gain: 130dB; Output Current Per Channel: 80mA; Input Bias Current: -1.2uA; Nominal Supply Current: 1-1000uA; Min Supply Voltage: 2.7V; Number Of Channels: 1; Max Supply Voltage: 11V; Category: IC; Ipc Land Pattern Name: SOT65P210X95-6; Temperature Range Low: -40°C; Device Class L1: Integrated Circuits (ICs); Package: KS-6; Height: 1.1mm; Temperature Range High: +125°C; Device Class L3: Amplifiers - Op Amps; ComponentLink2Description: Datasheet; Device Class L2: Linear ICs; RoHS: TRUE; ComponentLink2URL: https://www.analog.com/media/en/technical-documentation/data-sheets/ADA4807-1_4807-2_4807-4.pdf; Automotive: No; Lead Free: Yes; Digikey Description: IC OPAMP VFB 1 CIRCUIT SC70-6; Mouser Description: Operational Amplifiers - Op Amps Ultra Low Pwr 120MHz High Spd R/R AMP; Manufacturer Part Number: ADA4807-1AKSZ-R2; Temperature: -40°C to +125°C; Octopart: https://octopart.com/ada4807-1aksz-r2-analog+devices-52932031
U5 = CMP-0272-01739-3: 20 MHz, Low Noise, RRIO, CMOS Operational Amplifier, 1.8 to 5.5 V, -40 to 125 degC, 14-pin SOP (PW14), Green (RoHS & no Sb/Br); Manufacturer: Texas Instruments; Sub Family: High Output Current Amplifier (>=50mA), Low Input Bias Current Amp (<=10pA), Low Noise Amp (<=10nV/rtHz), Low Supply Voltage Amplifier (<=2.7V), Precision Amplifier; Vio (25C)(Max)(mV): 2; IIB(Max)(pA): 10; Total Supply Voltage(Max)(+5V is 5, +/-5V is 10): 5.5; Iq per channel(Max)(mA): 1.65; Total Supply Voltage(Min)(+5V is 5, +/-5V is 10): 1.8; Rating: Catalog; CMRR(Min)(dB): 90; Packing: LARGE T&R; Number of Channels: 4; GBW(Typ)(MHz): 20; ComponentLink2URL: http://www.ti.com/lit/ds/symlink/opa4322.pdf; ComponentLink1URL: http://www.ti.com/; ComponentLink2Description: Datasheet; ComponentLink3URL: http://www.ti.com/litv/pdf/mpds360; PackageReference: PW0014A; Mounting Technology: Surface Mount; PartNumber: OPA4322AIPWR; Eco-Plan: Green (RoHS & no Sb/Br); ComponentLink3Description: Package Specification; ComponentLink1Description: Manufacturer URL; DatasheetVersion: SBOS538E; PackageDescription: 14-Pin Plastic Small Outline, Body 5 x 4.4 mm, Pitch 0.65 mm; PackageVersion: 4040064-3/G, 02/2011; Offset Drift(Typ)(uV/C): 1.8; Slew Rate(Typ)(V/us): 10; Code_JEDEC: MO-153
U6 = CMP-04892-000007-1: IC SWITCH SPST SOT23-5; Manufacturer: Texas Instruments; Min Supply Voltage: 1.65V; On State Resistance: 0.7Ω; Nominal Supply Current: 0.01uA; Throw Configuration: SPST-NO; Standoff Height: 0mm; Max Junction Temp: +150°C; Number Of Circuits: 1; Max Supply Voltage: 5.5V; ComponentLink2Description: Datasheet; Temperature Range High: +85°C; Temperature: -40°C to +85°C; Automotive: No; Device Class L2: Interface ICs; Manufacturer Part Number: TS5A3166DBVR; Ambient Temperature Range Low: -40°C; Package: DBV0005A; Device Class L1: Integrated Circuits (ICs); Lead Free: Yes; Category: IC; Digikey Description: IC SWITCH SPST SOT23-5; Mouser Description: 1-Ohm SPST Analog Switch 5-V/3.3-V Single-Channel Analog Switch 5-SOT-23 -40 to 85; Ambient Temperature Range High: +85°C; ComponentLink2URL: http://www.ti.com/lit/ds/symlink/ts5a3166.pdf; Temperature Range Low: -40°C; Device Class L3: Analog Switches; Octopart: https://octopart.com/ts5a3166dbvr-texas+instruments-512330; RoHS: TRUE; Height: 1.45mm; JLCPCB Part Number: C353035
U7 = CMP-09083-000109-1: IC DGT POT 10KOHM 256TAP SOT23-8; Resistance: 10kR; Number of Positions: 256; Frequency: 400kHz; Quiescent Current: 3uA; Resistance Tolerance: 30%; Memory Type: Volatile; -3db Bandwidth: 1.2MHz; Operating Supply Voltage: 5.5V; Number of Circuits: 1; Interface: I2C; Temperature Coefficient: 45ppm/°C; Min Supply Voltage: 2.7V; Max Supply Current: 3uA; REACH SVHC: No SVHC; Lead Free: Contains Lead; Package Quantity: 3000; Number of Taps: 256; Case/Package: SOT-23; Operating Supply Current: 3uA; Mount: Surface Mount; RoHS Compliant: Yes; Supply Current: 3uA; Series: -; Number of Pins: 8; Min Operating Temperature: -40°C; Contact Plating: Gold; Max Operating Temperature: 125°C; Packaging: Tape and Reel; Max Supply Voltage: 5.5V; Nominal Supply Current: 3uA; Number of Elements: 1; Taper: Linear; Tolerance: 30%; Radiation Hardening: No; JLCPCB Part Number: C144256
U8 = CMP-0272-00923-3: 50 MHz, Low-Noise, Single-Supply Rail-to-Rail Operational Amplifier, 2.2 to 5.5 V, -40 to 125 degC, 5-pin SOT23 (DBV5), Green (RoHS & no Sb/Br); Manufacturer: Texas Instruments; Total Supply Voltage(Max)(+5V is 5, +/-5V is 10): 5.5; Sub Family: High Speed Amplifier (>=50MHz), Low Input Bias Current Amp (<=10pA), Low Noise Amp (<=10nV/rtHz), Low Offset Voltage Amplifier (<=500uV), Low Supply Voltage Amplifier (<=2.7V); CMRR(Min)(dB): 100; Total Supply Voltage(Min)(+5V is 5, +/-5V is 10): 2.2; Slew Rate(Typ)(V/us): 25; Number of Channels: 1; IIB(Max)(pA): 10; Vio (25C)(Max)(mV): 0.2; Iq per channel(Max)(mA): 5; PackageReference: DBV0005A; PackageDescription: 5-Pin Plastic Small Outline, Body 1.6 x 2.9 mm, Pitch 0.95 mm; PartNumber: OPA365AIDBVR; ComponentLink1Description: Manufacturer URL; ComponentLink3URL: http://www.ti.com/litv/pdf/mpds018i; Mounting Technology: Surface Mount; DatasheetVersion: SBOS365D; ComponentLink3Description: Package Specification; ComponentLink2URL: http://www.ti.com/general/docs/lit/getliterature.tsp?genericPartNumber=OPA365&fileType=pdf; PackageVersion: 4073253-4/K, 03/2006; Eco-Plan: Green (RoHS & no Sb/Br); ComponentLink1URL: http://www.ti.com/; Offset Drift(Typ)(uV/C): 1; ComponentLink2Description: Datasheet; Code_JEDEC: MO-178; JLCPCB Part Number: C96626
U9 = CMP-0859-00019-3: Single Bus Buffer Gate With 3-State Outputs, DBV0005A, LARGE T&R; Manufacturer: Texas Instruments; VCC(Min)(V): 1.65; Sub-Family: Non-Inverting Buffer/Driver; tpd @ Nom Voltage(Max)(ns): 9,5.5,4.5,4; Input Type: CMOS/TTL; ICC @ Nom Voltage(Max)(mA): 0.01; Schmitt Trigger: No; Voltage(Nom)(V): 1.8,2.5,3.3,5; F @ Nom Voltage(Max)(Mhz): 150; Output Drive (IOL/IOH)(Max)(mA): 32/-32; 3-State Output: Yes; Output Type: CMOS; Bits(#): 1; Rating: Catalog; Technology Family: LVC; Logic: True; VCC(Max)(V): 5.5; PackageReference: DBV0005A; DatasheetVersion: SCES223T; Generic Part Number: SN74LVC1G125; Operating Temperature Range(C): -40 to 125,-40 to 85; JLCPCB Part Number: C23654